# EAGLE design con68k-switch (EAGLE 7.6.0)
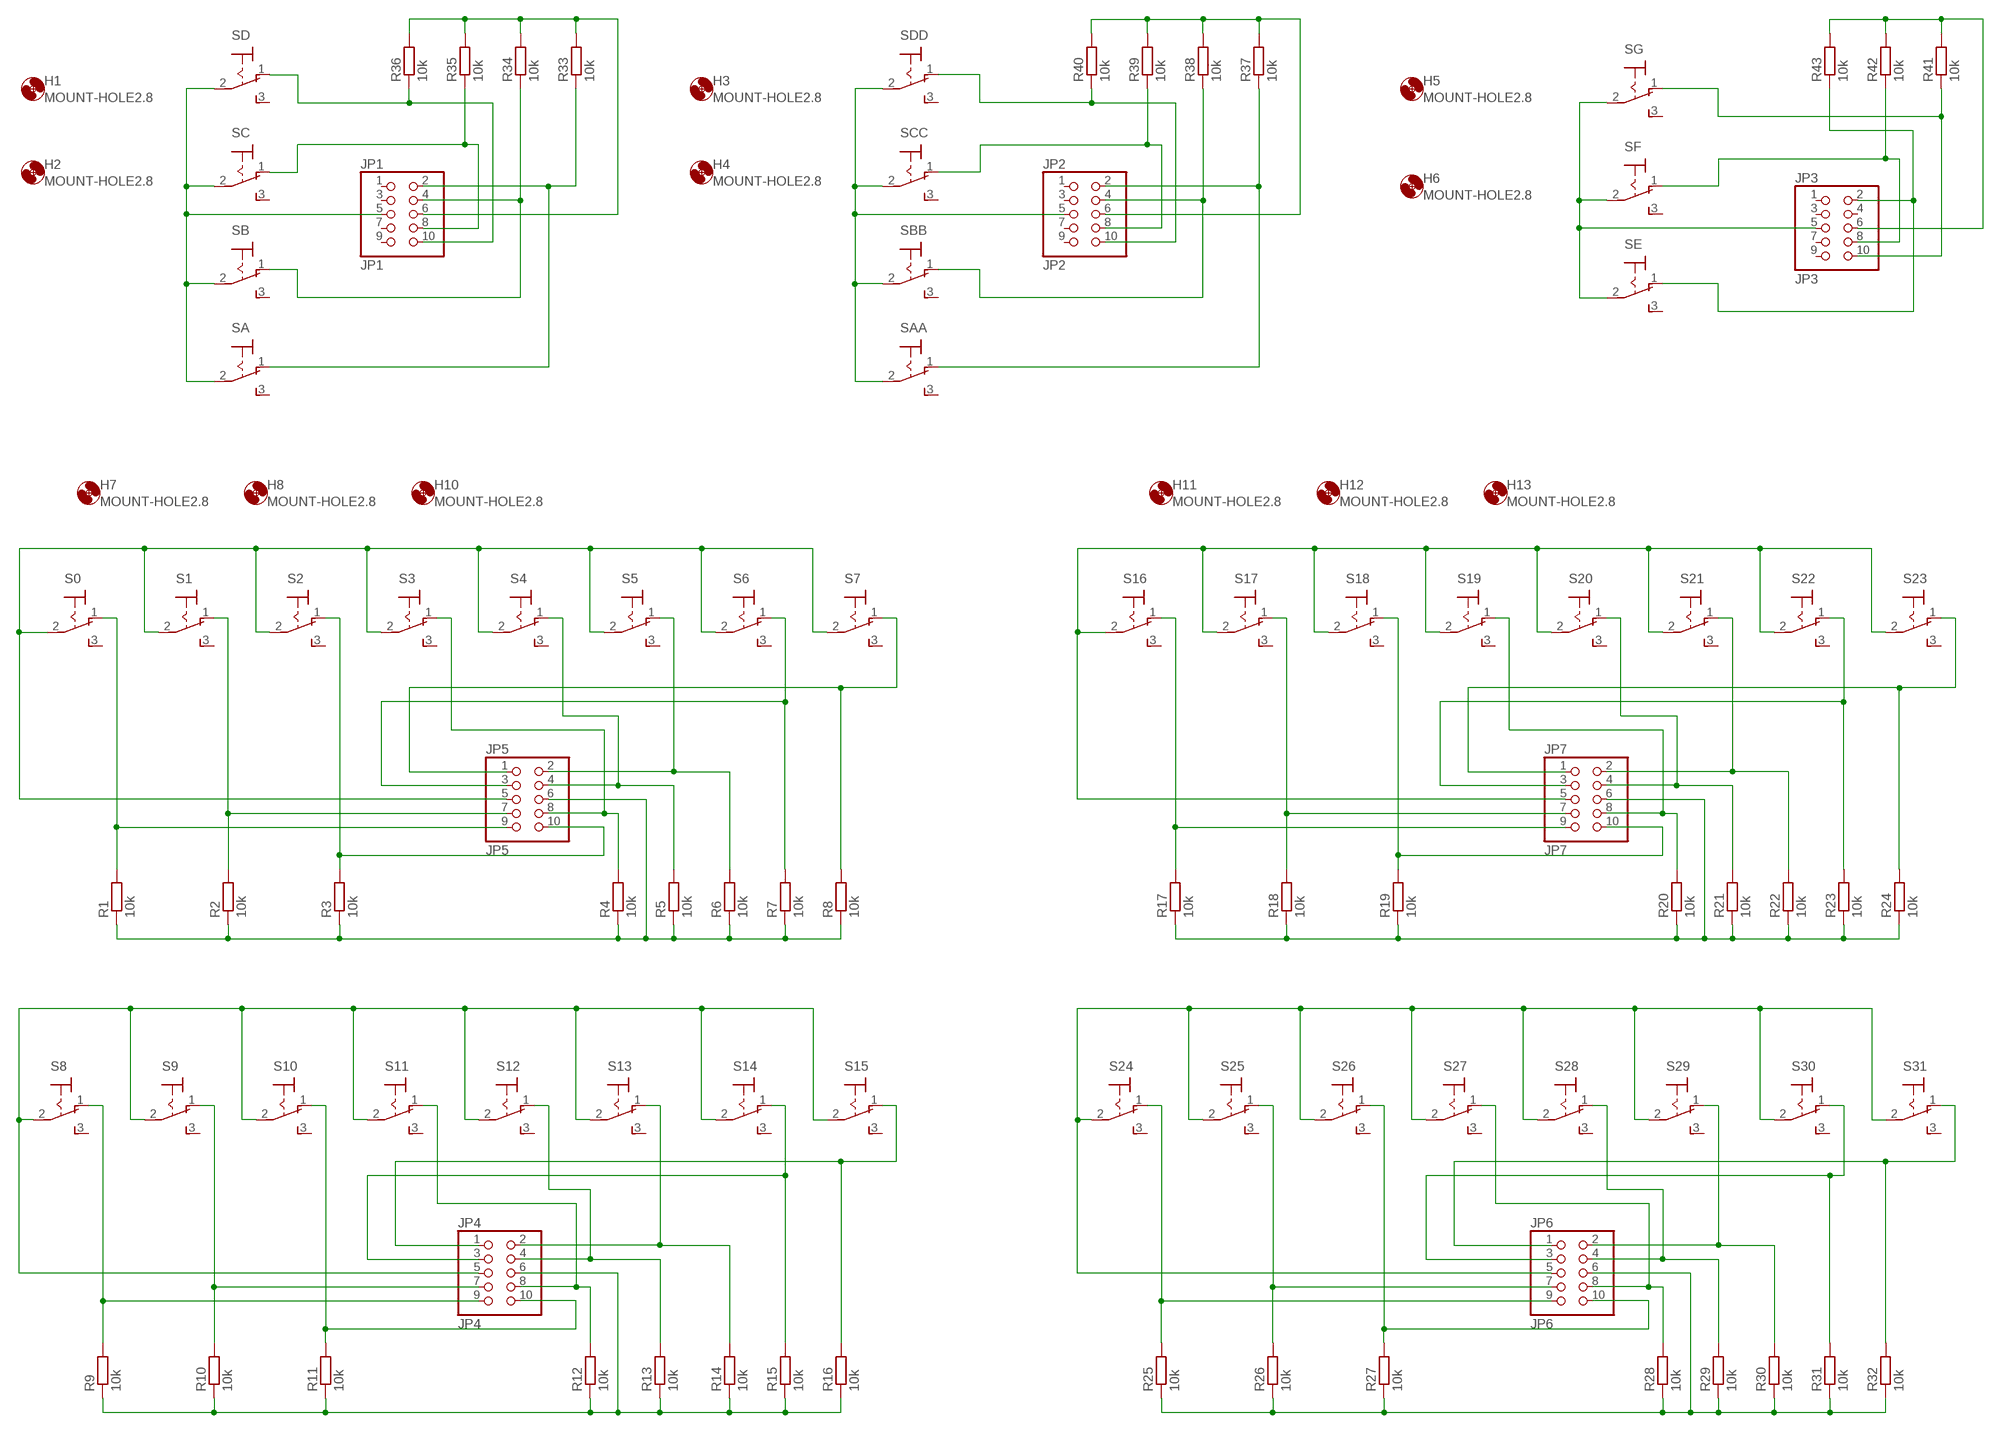
[diagram p0: schematic, sheet 1]

## Parts
H1  MOUNT-HOLE2.8  [2,8]
H2  MOUNT-HOLE2.8  [2,8]
H3  MOUNT-HOLE2.8  [2,8]
H4  MOUNT-HOLE2.8  [2,8]
H5  MOUNT-HOLE2.8  [2,8]
H6  MOUNT-HOLE2.8  [2,8]
H7  MOUNT-HOLE2.8  [2,8]
H8  MOUNT-HOLE2.8  [2,8]
H10  MOUNT-HOLE2.8  [2,8]
H11  MOUNT-HOLE2.8  [2,8]
H12  MOUNT-HOLE2.8  [2,8]
H13  MOUNT-HOLE2.8  [2,8]
JP1  JP1  PINHD-2X5  [2X05]
JP2  JP2  PINHD-2X5  [2X05]
JP3  JP3  PINHD-2X5  [2X05]
JP4  JP4  PINHD-2X5  [2X05]
JP5  JP5  PINHD-2X5  [2X05]
JP6  JP6  PINHD-2X5  [2X05]
JP7  JP7  PINHD-2X5  [2X05]
R1  10k  R-EU_0204/7  [0204/7]
R2  10k  R-EU_0204/7  [0204/7]
R3  10k  R-EU_0204/7  [0204/7]
R4  10k  R-EU_0204/7  [0204/7]
R5  10k  R-EU_0204/7  [0204/7]
R6  10k  R-EU_0204/7  [0204/7]
R7  10k  R-EU_0204/7  [0204/7]
R8  10k  R-EU_0204/7  [0204/7]
R9  10k  R-EU_0204/7  [0204/7]
R10  10k  R-EU_0204/7  [0204/7]
R11  10k  R-EU_0204/7  [0204/7]
R12  10k  R-EU_0204/7  [0204/7]
R13  10k  R-EU_0204/7  [0204/7]
R14  10k  R-EU_0204/7  [0204/7]
R15  10k  R-EU_0204/7  [0204/7]
R16  10k  R-EU_0204/7  [0204/7]
R17  10k  R-EU_0204/7  [0204/7]
R18  10k  R-EU_0204/7  [0204/7]
R19  10k  R-EU_0204/7  [0204/7]
R20  10k  R-EU_0204/7  [0204/7]
R21  10k  R-EU_0204/7  [0204/7]
R22  10k  R-EU_0204/7  [0204/7]
R23  10k  R-EU_0204/7  [0204/7]
R24  10k  R-EU_0204/7  [0204/7]
R25  10k  R-EU_0204/7  [0204/7]
R26  10k  R-EU_0204/7  [0204/7]
R27  10k  R-EU_0204/7  [0204/7]
R28  10k  R-EU_0204/7  [0204/7]
R29  10k  R-EU_0204/7  [0204/7]
R30  10k  R-EU_0204/7  [0204/7]
R31  10k  R-EU_0204/7  [0204/7]
R32  10k  R-EU_0204/7  [0204/7]
R33  10k  R-EU_0204/7  [0204/7]
R34  10k  R-EU_0204/7  [0204/7]
R35  10k  R-EU_0204/7  [0204/7]
R36  10k  R-EU_0204/7  [0204/7]
R37  10k  R-EU_0204/7  [0204/7]
R38  10k  R-EU_0204/7  [0204/7]
R39  10k  R-EU_0204/7  [0204/7]
R40  10k  R-EU_0204/7  [0204/7]
R41  10k  R-EU_0204/7  [0204/7]
R42  10k  R-EU_0204/7  [0204/7]
R43  10k  R-EU_0204/7  [0204/7]
S0  M9040P  [M9040P]
S1  M9040P  [M9040P]
S2  M9040P  [M9040P]
S3  M9040P  [M9040P]
S4  M9040P  [M9040P]
S5  M9040P  [M9040P]
S6  M9040P  [M9040P]
S7  M9040P  [M9040P]
S8  M9040P  [M9040P]
S9  M9040P  [M9040P]
S10  M9040P  [M9040P]
S11  M9040P  [M9040P]
S12  M9040P  [M9040P]
S13  M9040P  [M9040P]
S14  M9040P  [M9040P]
S15  M9040P  [M9040P]
S16  M9040P  [M9040P]
S17  M9040P  [M9040P]
S18  M9040P  [M9040P]
S19  M9040P  [M9040P]
S20  M9040P  [M9040P]
S21  M9040P  [M9040P]
S22  M9040P  [M9040P]
S23  M9040P  [M9040P]
S24  M9040P  [M9040P]
S25  M9040P  [M9040P]
S26  M9040P  [M9040P]
S27  M9040P  [M9040P]
S28  M9040P  [M9040P]
S29  M9040P  [M9040P]
S30  M9040P  [M9040P]
S31  M9040P  [M9040P]
SA  M9040P  [M9040P]
SAA  M9040P  [M9040P]
SB  M9040P  [M9040P]
SBB  M9040P  [M9040P]
SC  M9040P  [M9040P]
SCC  M9040P  [M9040P]
SD  M9040P  [M9040P]
SDD  M9040P  [M9040P]
SE  M9040P  [M9040P]
SF  M9040P  [M9040P]
SG  M9040P  [M9040P]

## Nets
N$1: JP1.2 R33.1 SA.1(O)
N$2: JP1.8 R35.1 SC.1(O)
N$3: JP1.10 R36.1 SD.1(O)
N$4: JP1.4 R34.1 SB.1(O)
N$5: JP1.6 R33.2 R34.2 R35.2 R36.2
N$6: JP1.5 SA.2(P) SB.2(P) SC.2(P) SD.2(P)
N$7: JP2.8 R39.1 SCC.1(O)
N$8: JP2.10 R40.1 SDD.1(O)
N$9: JP2.5 SAA.2(P) SBB.2(P) SCC.2(P) SDD.2(P)
N$10: JP2.4 R38.1 SBB.1(O)
N$11: JP2.2 R37.1 SAA.1(O)
N$12: JP2.6 R37.2 R38.2 R39.2 R40.2
N$13: JP3.5 SE.2(P) SF.2(P) SG.2(P)
N$14: JP3.2 R43.1 SE.1(O)
N$15: JP3.10 R41.1 SG.1(O)
N$16: JP3.6 R41.2 R42.2 R43.2
N$18: JP3.8 R42.1 SF.1(O)
N$23: JP4.5 S8.2(P) S9.2(P) S10.2(P) S11.2(P) S12.2(P) S13.2(P) S14.2(P) S15.2(P)
N$24: JP4.3 R15.2 S14.1(O)
N$25: JP4.2 R14.2 S13.1(O)
N$26: JP4.4 R13.2 S12.1(O)
N$27: JP4.8 R12.2 S11.1(O)
N$28: JP4.10 R11.2 S10.1(O)
N$29: JP4.7 R10.2 S9.1(O)
N$30: JP4.9 R9.2 S8.1(O)
N$31: JP4.6 R9.1 R10.1 R11.1 R12.1 R13.1 R14.1 R15.1 R16.1
N$32: JP4.1 R16.2 S15.1(O)
N$33: JP6.6 R25.1 R26.1 R27.1 R28.1 R29.1 R30.1 R31.1 R32.1
N$34: JP6.3 R31.2 S30.1(O)
N$35: JP7.1 R24.2 S23.1(O)
N$36: JP7.3 R23.2 S22.1(O)
N$37: JP7.2 R22.2 S21.1(O)
N$40: JP5.5 S0.2(P) S1.2(P) S2.2(P) S3.2(P) S4.2(P) S5.2(P) S6.2(P) S7.2(P)
N$41: JP7.10 R19.2 S18.1(O)
N$42: JP5.6 R1.1 R2.1 R3.1 R4.1 R5.1 R6.1 R7.1 R8.1
N$43: JP6.5 S24.2(P) S25.2(P) S26.2(P) S27.2(P) S28.2(P) S29.2(P) S30.2(P) S31.2(P)
N$44: JP6.2 R30.2 S29.1(O)
N$45: JP6.4 R29.2 S28.1(O)
N$46: JP6.8 R28.2 S27.1(O)
N$47: JP6.10 R27.2 S26.1(O)
N$48: JP6.7 R26.2 S25.1(O)
N$49: JP6.9 R25.2 S24.1(O)
N$51: JP5.1 R8.2 S7.1(O)
N$52: JP6.1 R32.2 S31.1(O)
N$53: JP5.3 R7.2 S6.1(O)
N$54: JP7.5 S16.2(P) S17.2(P) S18.2(P) S19.2(P) S20.2(P) S21.2(P) S22.2(P) S23.2(P)
N$56: JP7.4 R21.2 S20.1(O)
N$57: JP7.8 R20.2 S19.1(O)
N$59: JP5.9 R1.2 S0.1(O)
N$61: JP5.2 R6.2 S5.1(O)
N$62: JP5.4 R5.2 S4.1(O)
N$63: JP5.8 R4.2 S3.1(O)
N$64: JP5.10 R3.2 S2.1(O)
N$65: JP5.7 R2.2 S1.1(O)
N$67: JP7.7 R18.2 S17.1(O)
N$68: JP7.9 R17.2 S16.1(O)
N$71: JP7.6 R17.1 R18.1 R19.1 R20.1 R21.1 R22.1 R23.1 R24.1
Unconnected: JP1.1 JP1.3 JP1.7 JP1.9 JP2.1 JP2.3 JP2.7 JP2.9 JP3.1 JP3.3 JP3.4 JP3.7 JP3.9 S0.3(S) S1.3(S) S2.3(S) S3.3(S) S4.3(S) S5.3(S) S6.3(S) S7.3(S) S8.3(S) S9.3(S) S10.3(S) S11.3(S) S12.3(S) S13.3(S) S14.3(S) S15.3(S) S16.3(S) S17.3(S) S18.3(S) S19.3(S) S20.3(S) S21.3(S) S22.3(S) S23.3(S) S24.3(S) S25.3(S) S26.3(S) S27.3(S) S28.3(S) S29.3(S) S30.3(S) S31.3(S) SA.3(S) SAA.3(S) SB.3(S) SBB.3(S) SC.3(S) SCC.3(S) SD.3(S) SDD.3(S) SE.3(S) SF.3(S) SG.3(S)

## Library data of the parts
H1-H8 H10-H13 = holes:MOUNT-HOLE: MOUNTING HOLE with drill center marker
JP1-JP7 = pinhead:PINHD-2X5: PIN HEADER
R1-R43 = rcl:R-EU_: RESISTOR, European symbol
S0 S1-S31 SA SAA SB SBB SC SCC SD SDD SE SF SG = switch:M9040P: TOGGLE SWITCH Marquardt

## Net classes
0 default: width 0.254 mm, drill 0.254 mm, clearance 0.254 mm

## Board
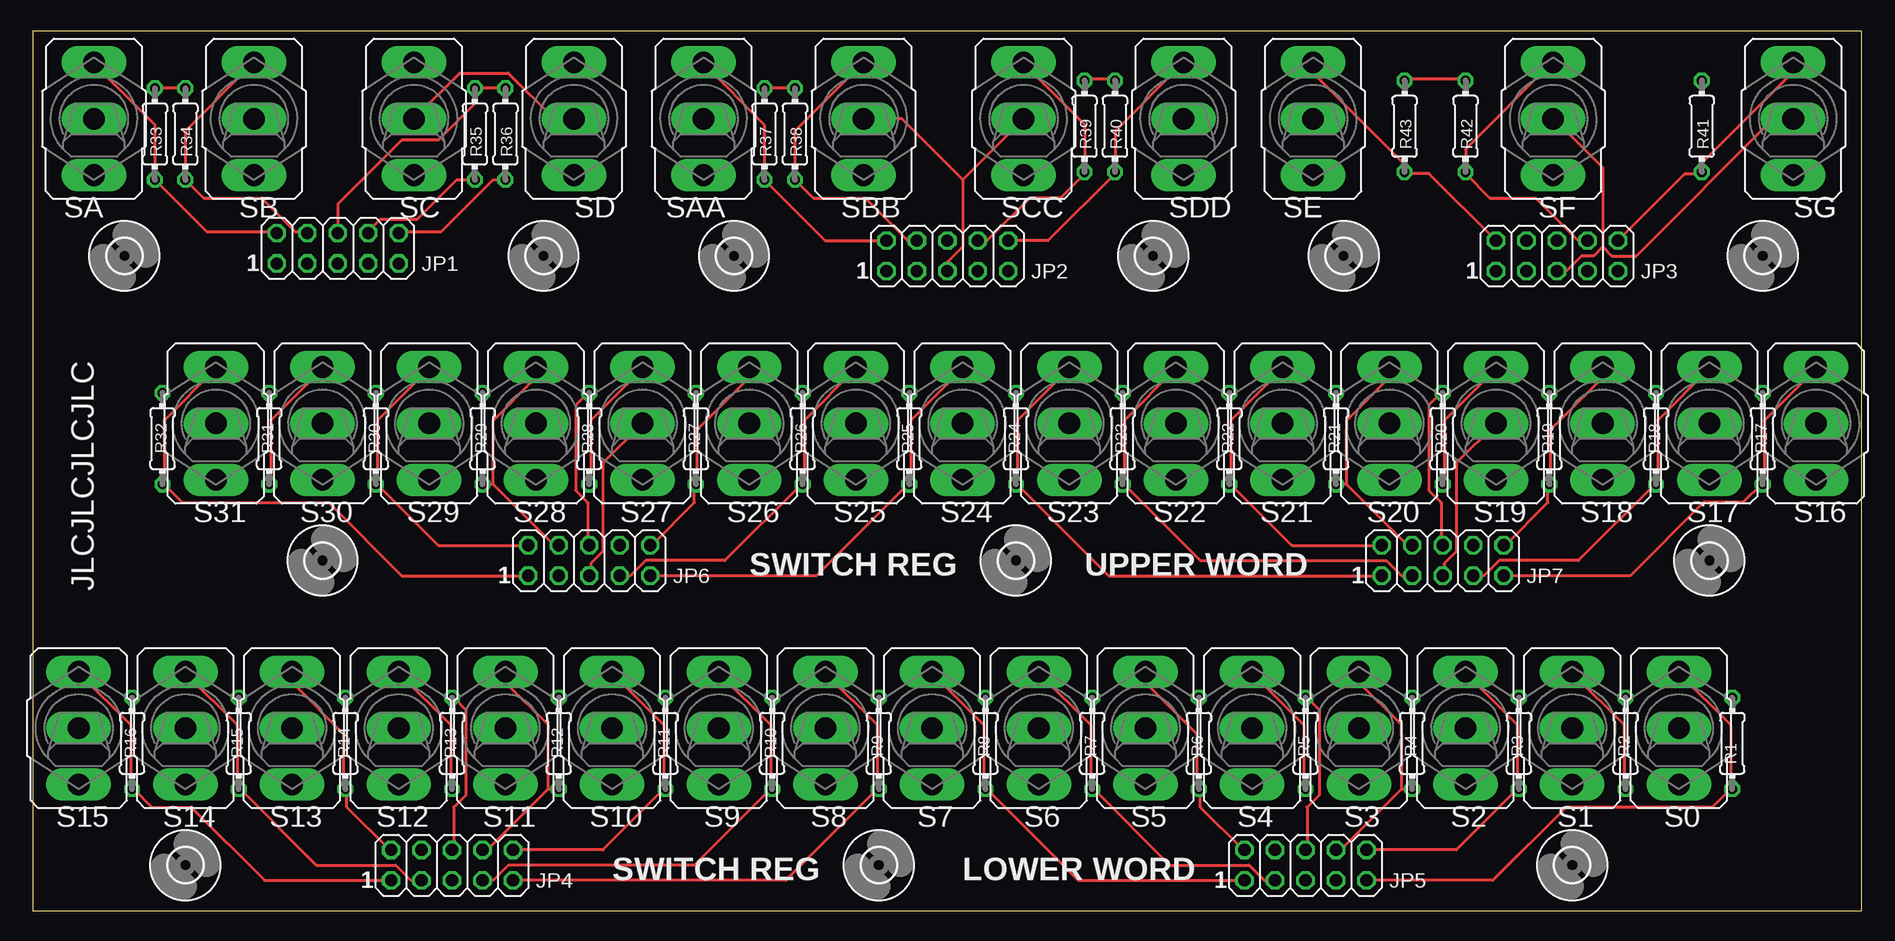
[diagram p1: board, top side]
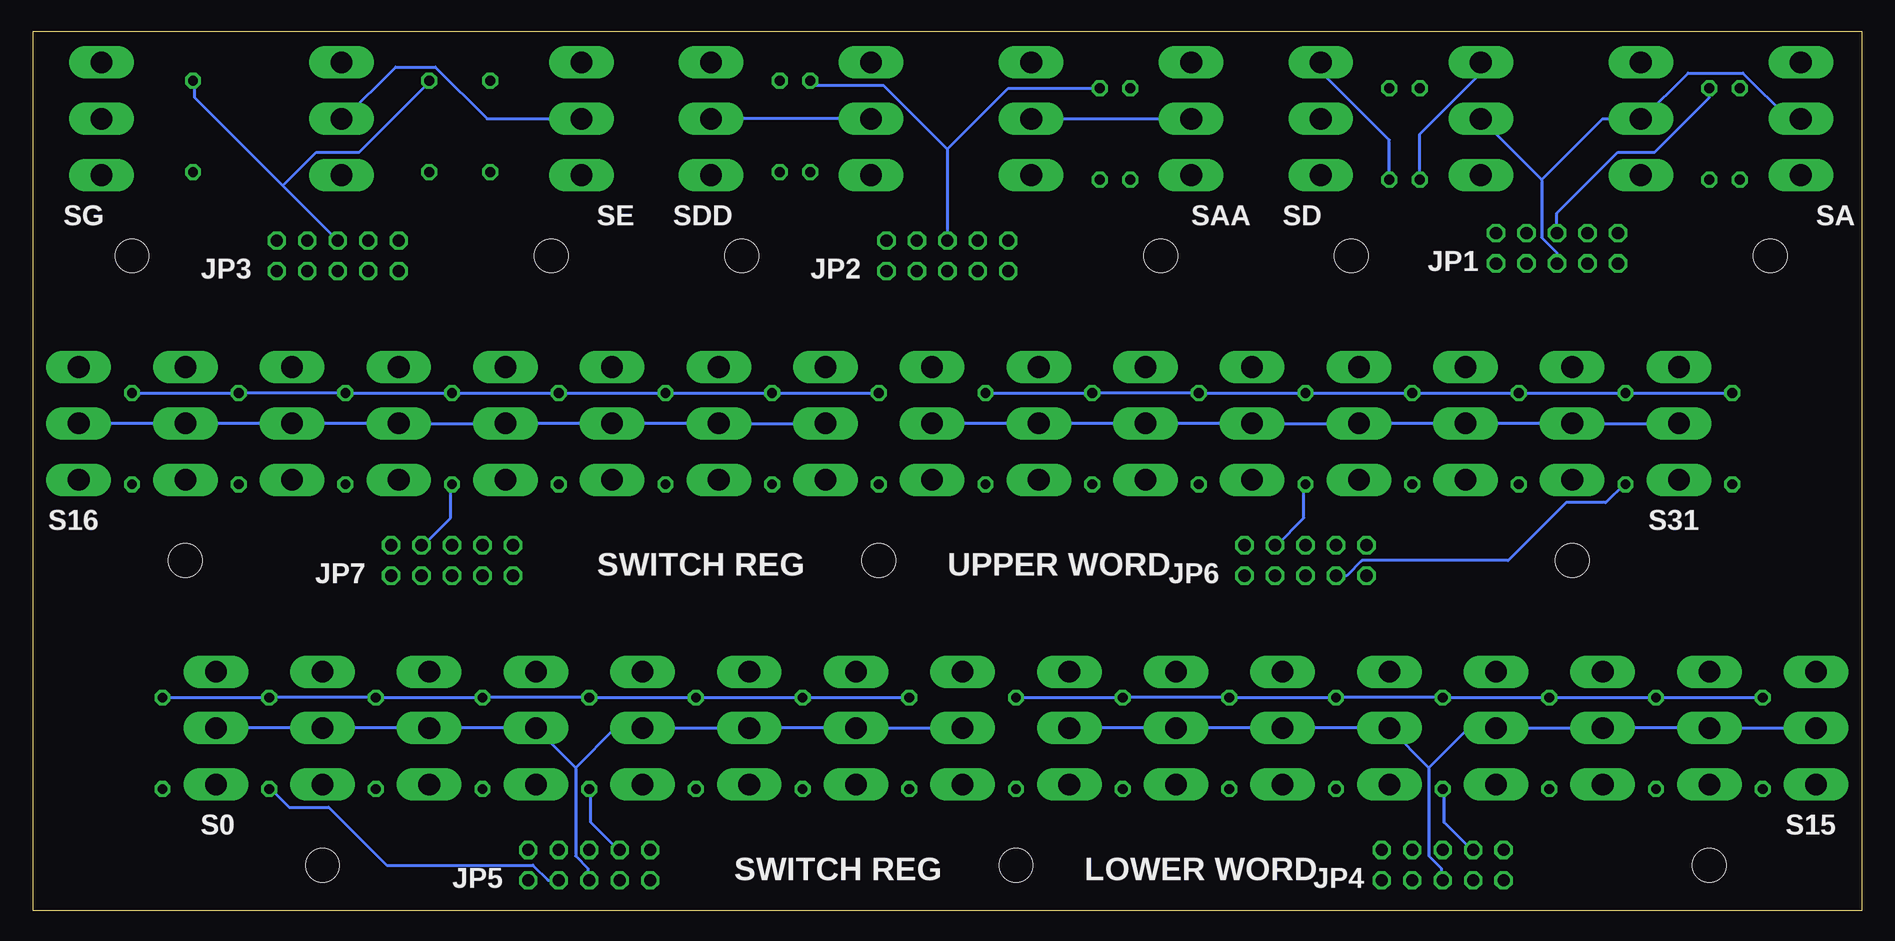
[diagram p2: board, bottom side, seen from below]

Size 152.38 x 73.33 mm. Coordinates in mm from the lower left corner, seen from the top.
Outline: 0,0 152.38,0 152.38,73.33 0,73.33 0,0
Copper layers (1*16): Top 0.035mm / dielectric 1.5mm / Bottom 0.035mm
Design rules "ITEADstudio_DRC": minimum track width 6mil, minimum drill 12mil, track to track 6mil, track to pad 6mil, pad to pad 6mil, via to via 6mil, smd to smd 0mil, copper to edge 10mil, drill to drill 10mil, minimum pad ring 10mil, minimum via ring 6mil, stop-mask expansion 2mil, vias tented up to drill 100mil, thermal gap 10mil

### Footprints (pad centres in the part's own frame; a part is rotated, then mirrored left to right if it is on the bottom)
2,8 = hole 2.8: 0,0
2X05 = drill 1.016 octagon: 1 -5.08,-1.27; 2 -5.08,1.27; 3 -2.54,-1.27; 4 -2.54,1.27; 5 0,-1.27; 6 0,1.27; 7 2.54,-1.27; 8 2.54,1.27; 9 5.08,-1.27; 10 5.08,1.27
0204/7 = drill 0.813 octagon: 1 -3.81,0; 2 3.81,0
M9040P = drill 1.803 long: 1 0,4.699; 2 0,0; 3 0,-4.699

### Placement (x,y rotation side)
H1  7.62,54.61 0 top
H2  42.55,54.61 0 top
H3  58.42,54.61 0 top
H4  93.34,54.61 0 top
H5  109.22,54.61 0 top
H6  144.15,54.61 0 top
H7  12.7,3.81 0 top
H8  70.48,3.81 0 top
H10  128.27,3.81 0 top
H11  24.13,29.21 0 top
H12  81.92,29.21 0 top
H13  139.7,29.21 0 top
JP1  25.4,55.24 0 top
JP2  76.2,54.61 0 top
JP3  127,54.61 0 top
JP4  34.92,3.81 0 top
JP5  106.05,3.81 0 top
JP6  46.35,29.21 0 top
JP7  117.47,29.21 0 top
R1  141.6,13.97 270 top
R2  132.72,13.97 270 top
R3  123.83,13.97 270 top
R4  114.94,13.97 270 top
R5  106.05,13.97 270 top
R6  97.16,13.97 270 top
R7  88.27,13.97 270 top
R8  79.38,13.97 270 top
R9  70.48,13.97 270 top
R10  61.59,13.97 270 top
R11  52.7,13.97 270 top
R12  43.81,13.97 270 top
R13  34.92,13.97 270 top
R14  26.04,13.97 270 top
R15  17.14,13.97 270 top
R16  8.26,13.97 270 top
R17  144.15,39.37 270 top
R18  135.25,39.37 270 top
R19  126.36,39.37 270 top
R20  117.47,39.37 270 top
R21  108.58,39.37 270 top
R22  99.69,39.37 270 top
R23  90.81,39.37 270 top
R24  81.92,39.37 270 top
R25  73.03,39.37 270 top
R26  64.14,39.37 270 top
R27  55.24,39.37 270 top
R28  46.35,39.37 270 top
R29  37.47,39.37 270 top
R30  28.57,39.37 270 top
R31  19.68,39.37 270 top
R32  10.79,39.37 270 top
R33  10.16,64.77 90 top
R34  12.7,64.77 90 top
R35  36.83,64.77 90 top
R36  39.37,64.77 90 top
R37  60.96,64.77 90 top
R38  63.5,64.77 90 top
R39  87.63,65.41 90 top
R40  90.17,65.41 90 top
R41  139.06,65.41 90 top
R42  119.38,65.41 90 top
R43  114.3,65.41 90 top
S0  137.16,15.24 0 top
S1  128.27,15.24 0 top
S2  119.38,15.24 0 top
S3  110.49,15.24 0 top
S4  101.6,15.24 0 top
S5  92.71,15.24 0 top
S6  83.82,15.24 0 top
S7  74.93,15.24 0 top
S8  66.04,15.24 0 top
S9  57.15,15.24 0 top
S10  48.26,15.24 0 top
S11  39.37,15.24 0 top
S12  30.48,15.24 0 top
S13  21.59,15.24 0 top
S14  12.7,15.24 0 top
S15  3.81,15.24 0 top
S16  148.59,40.64 0 top
S17  139.7,40.64 0 top
S18  130.81,40.64 0 top
S19  121.92,40.64 0 top
S20  113.03,40.64 0 top
S21  104.14,40.64 0 top
S22  95.25,40.64 0 top
S23  86.36,40.64 0 top
S24  77.47,40.64 0 top
S25  68.58,40.64 0 top
S26  59.69,40.64 0 top
S27  50.8,40.64 0 top
S28  41.91,40.64 0 top
S29  33.02,40.64 0 top
S30  24.13,40.64 0 top
S31  15.24,40.64 0 top
SA  5.08,66.04 0 top
SAA  55.88,66.04 0 top
SB  18.41,66.04 0 top
SBB  69.22,66.04 0 top
SC  31.75,66.04 0 top
SCC  82.55,66.04 0 top
SD  45.09,66.04 0 top
SDD  95.89,66.04 0 top
SE  106.68,66.04 0 top
SF  126.68,66.04 0 top
SG  146.69,66.04 0 top

### Tracks (layer width: path | path; a pad name or v marks a point on that pad's centre or on a via)
N$1
  Top 0.254: SA.1 5.08,70.61 10.16,65.53 R33.1 14.48,56.64 20.32,56.64 JP1.2
N$2
  Top 0.254: R35.1 35.31,60.96 32,57.66 28.96,57.66 27.94,56.64 JP1.8
  Bottom 0.254: SC.1 31.75,69.85 36.83,64.77 R35.1
N$3
  Top 0.254: R36.1 38.35,60.96 34.04,56.64 30.48,56.64 JP1.10
  Bottom 0.254: R36.1 39.37,64.26 44.96,69.85 44.96,70.61 SD.1
N$4
  Top 0.254: SB.1 12.7,65.02 R34.1 14.22,59.44 19.05,59.44 21.84,56.64 22.86,56.64 JP1.4
N$5
  Top 0.254: R34.2 R33.2 | R36.2 R35.2 36.83,67.31 33.78,64.26 30.73,64.26 25.4,58.93 JP1.6
  Bottom 0.254: R34.2 12.7,67.82 17.27,63.25 20.32,63.25 25.4,58.17 JP1.6
N$6
  Top 0.254: SD.2 43.43,66.04 39.62,69.85 35.56,69.85 SC.2
  Bottom 0.254: SA.2 6.1,66.04 9.91,69.85 14.48,69.85 18.29,66.04 SB.2 21.59,66.04 26.67,60.96 | JP1.5 25.4,54.86 26.67,56.13 26.67,60.96 | SC.2 26.67,60.96
N$7
  Top 0.254: SCC.1 82.55,70.61 87.63,65.53 R39.1 87.63,61.47 85.6,59.44 83.06,59.44 79.5,55.88 JP2.8
N$8
  Top 0.254: SDD.1 90.17,65.02 R40.1 90.17,61.47 84.58,55.88 JP2.10
N$9
  Top 0.254: JP2.5 76.2,54.1 77.47,55.37 77.47,60.96 | SCC.2 77.47,60.96 | SBB.2 72.39,66.04 77.47,60.96
  Bottom 0.254: SBB.2 SAA.2 | SCC.2 SDD.2
N$10
  Top 0.254: SBB.1 63.5,65.02 R38.1 65.02,59.44 69.34,59.44 72.9,55.88 JP2.4
N$11
  Top 0.254: SAA.1 55.88,70.61 60.96,65.53 R37.1 66.04,55.88 JP2.2
N$12
  Top 0.254: R38.2 R37.2 | R39.2 87.63,69.34 90.17,69.34 R40.2
  Bottom 0.254: 76.2,63.5 JP2.6 | 76.2,63.5 81.53,68.83 87.38,68.83 87.63,69.09 R39.2 | R38.2 71.12,68.58 76.2,63.5
N$13
  Top 0.254: JP3.5 127.76,53.34 129.03,54.61 130.05,54.61 130.81,55.37 | 130.81,55.37 130.81,61.98 126.75,66.04 SF.2 | SG.2 145.03,66.04 133.6,54.61 131.57,54.61 130.81,55.37
  Bottom 0.254: SE.2 114.55,66.04 118.87,70.36 122.17,70.36 126.49,66.04 SF.2
N$14
  Top 0.254: JP3.2 116.33,61.47 114.3,61.47 R43.1 114.3,62.23 106.68,69.85 SE.1
N$15
  Top 0.254: JP3.10 137.67,61.47 138.94,61.47 R41.1 139.19,61.72 139.19,62.48 146.56,69.85 146.56,70.61 SG.1
N$16
  Top 0.254: R43.2 114.3,69.34 119.38,69.34 R42.2
  Bottom 0.254: JP3.6 131.57,60.45 | 131.57,60.45 138.94,67.82 138.94,69.09 R41.2 | 131.57,60.45 128.78,63.25 125.22,63.25 119.38,69.09 R42.2
N$18
  Top 0.254: SF.1 126.49,70.61 119.38,63.5 R42.1 119.38,61.47 121.41,59.44 125.22,59.44 128.78,55.88 JP3.8
N$23
  Bottom 0.254: S15.2 S14.2 S13.2 S12.2 32.77,15.24 36.07,11.94 | 36.07,11.94 36.07,4.57 35.05,3.56 35.05,2.54 JP4.5 | 36.07,11.94 S11.2 S10.2 S9.2 S8.2
N$24
  Top 0.254: S14.1 12.7,19.81 17.02,15.49 17.02,10.16 R15.2 17.27,10.16 23.62,3.81 30.23,3.81 31.5,2.54 JP4.3
N$25
  Top 0.254: JP4.2 29.72,5.08 26.16,8.64 26.16,10.16 R14.2 25.91,10.16 25.91,14.73 21.59,19.05 S13.1
N$26
  Top 0.254: R13.2 34.8,10.16 34.8,15.49 30.48,19.81 S12.1
  Bottom 0.254: R13.2 34.8,10.16 34.8,7.37 32.51,5.08 JP4.4
N$27
  Top 0.254: 42.93,10.16 R12.2 | 42.93,10.16 37.85,5.08 JP4.8 | S11.1 39.37,19.05 42.93,15.49 42.93,10.16
N$28
  Top 0.254: 52.58,10.16 52.58,15.49 48.26,19.81 S10.1 | JP4.10 47.5,5.08 52.58,10.16 | 52.58,10.16 R11.2
N$29
  Top 0.254: 61.47,10.16 61.47,15.49 57.15,19.81 S9.1 | JP4.7 38.35,2.54 39.62,3.81 55.12,3.81 61.47,10.16 | 61.47,10.16 R10.2
N$30
  Top 0.254: 70.36,10.16 70.36,15.49 66.04,19.81 S8.1 | JP4.9 62.74,2.54 70.36,10.16 | 70.36,10.16 R9.2
N$31
  Top 0.254: JP4.6 35.05,5.08 35.05,8.64 36.07,9.65 36.07,16.76 35.05,17.78 R13.1
  Bottom 0.254: R9.1 R10.1 R11.1 R12.1 R13.1 R14.1 R15.1 R16.1
N$32
  Top 0.254: S15.1 3.81,19.81 8.13,15.49 8.13,10.16 R16.2 8.38,10.16 9.91,8.64 13.21,8.64 19.3,2.54 JP4.1
N$33
  Top 0.254: JP6.6 46.23,30.48 46.23,34.04 45.21,35.05 45.21,42.16 46.23,43.18 R28.1
  Bottom 0.254: R32.1 R31.1 R30.1 R29.1 R28.1 R27.1 R26.1 R25.1
N$34
  Top 0.254: R31.2 19.81,35.56 19.81,40.89 24.13,45.21 S30.1
  Bottom 0.254: JP6.3 42.93,27.94 41.66,29.21 29.46,29.21 24.64,34.04 21.34,34.04 19.81,35.56 R31.2
N$35
  Top 0.254: 82.04,35.56 82.04,40.89 86.36,45.21 S23.1 | JP7.1 89.66,27.94 82.04,35.56 | 82.04,35.56 R24.2
N$36
  Top 0.254: 90.93,35.56 90.93,40.89 95.25,45.21 S22.1 | JP7.3 114.05,27.94 112.78,29.21 97.28,29.21 90.93,35.56 | 90.93,35.56 R23.2
N$37
  Top 0.254: 99.82,35.56 99.82,40.89 104.14,45.21 S21.1 | JP7.2 104.9,30.48 99.82,35.56 | 99.82,35.56 R22.2
N$40
  Bottom 0.254: S7.2 S6.2 S5.2 S4.2 103.89,15.24 107.19,11.94 | 107.19,11.94 107.19,4.57 106.17,3.56 106.17,2.54 JP5.5 | 107.19,11.94 S3.2 S2.2 S1.2 S0.2
N$41
  Top 0.254: JP7.10 122.68,30.48 126.24,34.04 126.24,35.56 R19.2 126.49,35.56 126.49,40.13 130.81,44.45 S18.1
N$42
  Top 0.254: JP5.6 106.17,5.08 106.17,8.64 107.19,9.65 107.19,16.76 106.17,17.78 R5.1
  Bottom 0.254: R1.1 R2.1 R3.1 R4.1 R5.1 R6.1 R7.1 R8.1
N$43
  Top 0.254: S27.2 47.5,37.34 47.5,29.97 46.48,28.96 46.48,27.94 JP6.5
  Bottom 0.254: S31.2 S30.2 S29.2 S28.2 S27.2 S26.2 S25.2 S24.2
N$44
  Top 0.254: 28.7,35.56 28.7,40.89 33.02,45.21 S29.1 | JP6.2 33.78,30.48 28.7,35.56 | 28.7,35.56 R30.2
N$45
  Top 0.254: 38.35,35.56 R29.2 | 38.35,35.56 43.43,30.48 JP6.4 | S28.1 41.91,44.45 38.35,40.89 38.35,35.56
N$46
  Top 0.254: R28.2 46.48,35.56 46.48,40.89 50.8,45.21 S27.1
  Bottom 0.254: R28.2 46.48,35.56 46.48,32.77 48.77,30.48 JP6.8
N$47
  Top 0.254: JP6.10 51.56,30.48 55.12,34.04 55.12,35.56 R27.2 55.37,35.56 55.37,40.13 59.69,44.45 S26.1
N$48
  Top 0.254: S25.1 68.58,45.21 64.26,40.89 64.26,35.56 R26.2 64.01,35.56 57.66,29.21 51.05,29.21 49.78,27.94 JP6.7
N$49
  Top 0.254: S24.1 77.47,45.21 73.15,40.89 73.15,35.56 R25.2 72.9,35.56 65.28,27.94 JP6.9
N$51
  Top 0.254: S7.1 74.93,19.81 79.25,15.49 79.25,10.16 R8.2 79.5,10.16 87.12,2.54 JP5.1
N$52
  Top 0.254: 10.92,35.56 10.92,40.89 15.24,45.21 S31.1 | JP6.1 30.73,27.94 24.64,34.04 12.45,34.04 10.92,35.56 | 10.92,35.56 R32.2
N$53
  Top 0.254: S6.1 83.82,19.81 88.14,15.49 88.14,10.16 R7.2 88.39,10.16 94.74,3.81 101.35,3.81 102.62,2.54 JP5.3
N$54
  Top 0.254: S19.2 118.62,37.34 118.62,29.97 117.6,28.96 117.6,27.94 JP7.5
  Bottom 0.254: S23.2 S22.2 S21.2 S20.2 S19.2 S18.2 S17.2 S16.2
N$56
  Top 0.254: 109.47,35.56 R21.2 | 109.47,35.56 114.55,30.48 JP7.4 | S20.1 113.03,44.45 109.47,40.89 109.47,35.56
N$57
  Top 0.254: R20.2 117.6,35.56 117.6,40.89 121.92,45.21 S19.1
  Bottom 0.254: R20.2 117.6,35.56 117.6,32.77 119.89,30.48 JP7.8
N$59
  Top 0.254: 141.48,10.16 141.48,15.49 137.16,19.81 S0.1 | JP5.9 121.67,2.54 127.76,8.64 139.95,8.64 141.48,10.16 | 141.48,10.16 R1.2
N$61
  Top 0.254: JP5.2 100.84,5.08 97.28,8.64 97.28,10.16 R6.2 97.03,10.16 97.03,14.73 92.71,19.05 S5.1
N$62
  Top 0.254: R5.2 105.92,10.16 105.92,15.49 101.6,19.81 S4.1
  Bottom 0.254: R5.2 105.92,10.16 105.92,7.37 103.63,5.08 JP5.4
N$63
  Top 0.254: 114.05,10.16 R4.2 | 114.05,10.16 108.97,5.08 JP5.8 | S3.1 110.49,19.05 114.05,15.49 114.05,10.16
N$64
  Top 0.254: 123.7,10.16 123.7,15.49 119.38,19.81 S2.1 | JP5.10 118.62,5.08 123.7,10.16 | 123.7,10.16 R3.2
N$65
  Top 0.254: R2.2 132.59,10.16 132.59,15.49 128.27,19.81 S1.1
  Bottom 0.254: JP5.7 109.47,2.54 110.74,3.81 122.94,3.81 127.76,8.64 131.06,8.64 132.59,10.16 R2.2
N$67
  Top 0.254: S17.1 139.7,45.21 135.38,40.89 135.38,35.56 R18.2 135.13,35.56 128.78,29.21 122.17,29.21 120.9,27.94 JP7.7
N$68
  Top 0.254: S16.1 148.59,45.21 144.27,40.89 144.27,35.56 R17.2 144.02,35.56 142.49,34.04 139.19,34.04 133.1,27.94 JP7.9
N$71
  Top 0.254: JP7.6 117.35,30.48 117.35,34.04 116.33,35.05 116.33,42.16 117.35,43.18 R20.1
  Bottom 0.254: R24.1 R23.1 R22.1 R21.1 R20.1 R19.1 R18.1 R17.1

### Text on the board
tNames: 1 | 1 | 1 | SWITCH REG | UPPER WORD | JLCJLCJLCJLC | 1 | 1 | SWITCH REG | LOWER WORD | 1 | 1
bNames: SA | SD | SAA | SDD | SE | SG | JP1 | JP2 | JP3 | S31 | S16 | UPPER WORD | SWITCH REG | JP6 | JP7 | S15 | S0 | LOWER WORD | SWITCH REG | JP4 | JP5